# EAGLE schematic AirFlow_Sensor (EAGLE 8.6.0)
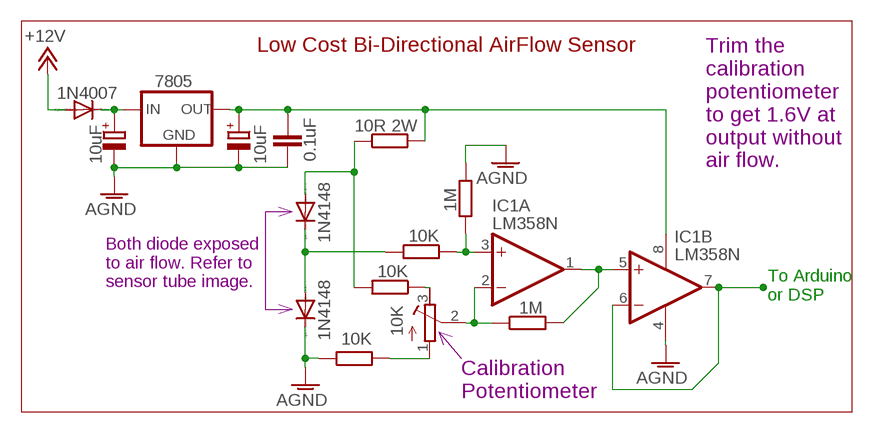
[diagram p0: schematic, sheet 1]

## Parts
C1  0.1uF  C-EU025-025X050  [C025-025X050]
C2  10uF  CPOL-EUE2.5-6  [E2,5-6]
C4  10uF  CPOL-EUE2.5-6  [E2,5-6]
CALIBRATION  10K  R-TRIMM64W  [RTRIM64W]
D2  1N4148  1N4148DO35-7  [DO35-7]
D3  1N4148  1N4148DO35-7  [DO35-7]
D4  1N4007  1N4004  [DO41-10]
IC1  LM358N  [DIL08]
IC2  7805  78XXL  [78XXL]
R1  10K  R-EU_0204/7  [0204/7]
R2  1M  R-EU_0204/7  [0204/7]
R3  1M  R-EU_0204/7  [0204/7]
R4  10K  R-EU_0204/7  [0204/7]
R5  10R 2W  R-EU_0204/7  [0204/7]
R7  10K  R-EU_0204/7  [0204/7]

## Nets
+12V: D4.A
AGND: C1.2 C2.- C4.- D2.C IC1.4(P:V-) IC2.GND R1.1 R3.2
N$1: IC1.6(B:-IN) IC1.7(B:OUT)
N$2: CALIBRATION.2(S) IC1.2(A:-IN) R2.1
N$3: IC1.1(A:OUT) IC1.5(B:+IN) R2.2
N$4: IC1.3(A:+IN) R3.1 R4.1
N$5: CALIBRATION.1(A) R1.2
N$6: D3.A R5.1 R7.2
N$7: D2.A D3.C R4.2
N$8: C2.+ D4.C IC2.IN
N$9: CALIBRATION.3(E) R7.1
N$10: C1.1 C4.+ IC1.8(P:V+) IC2.OUT R5.2

## Notes on the sheet
- Low Cost Bi-Directional AirFlow Sensor
- Trim the
  calibration
  potentiometer
  to get 1.6V at
  output without
  air flow.
- Both diode exposed
  to air flow. Refer to
  sensor tube image.
- To Arduino
  or DSP
- Calibration
  Potentiometer

## Library data of the parts
C1 = rcl:C-EU: CAPACITOR, European symbol; SPICEPREFIX: C
C2 C4 = rcl:CPOL-EU: POLARIZED CAPACITOR, European symbol; SPICEPREFIX: C
CALIBRATION = rcl:R-TRIMM: Trimm resistor; SPICEMODEL: X; SPICEPREFIXL: POT
D2 D3 = diode:1N4148: DIODE high speed (Philips)
D4 = diode:1N4004: DIODE general purpose rectifier, 1 A
IC1 = linear:LM358: OP AMP also LM158; LM258; LM2904 Source: http://cache.national.com/ds/LM/LM158.pdf
IC2 = v-reg:78XXL: VOLTAGE REGULATOR
R1-R5 R7 = rcl:R-EU_: RESISTOR, European symbol; SPICEPREFIX: R